# Altium schematic sheet SD Card.SchDoc
size 152 x 152 mm
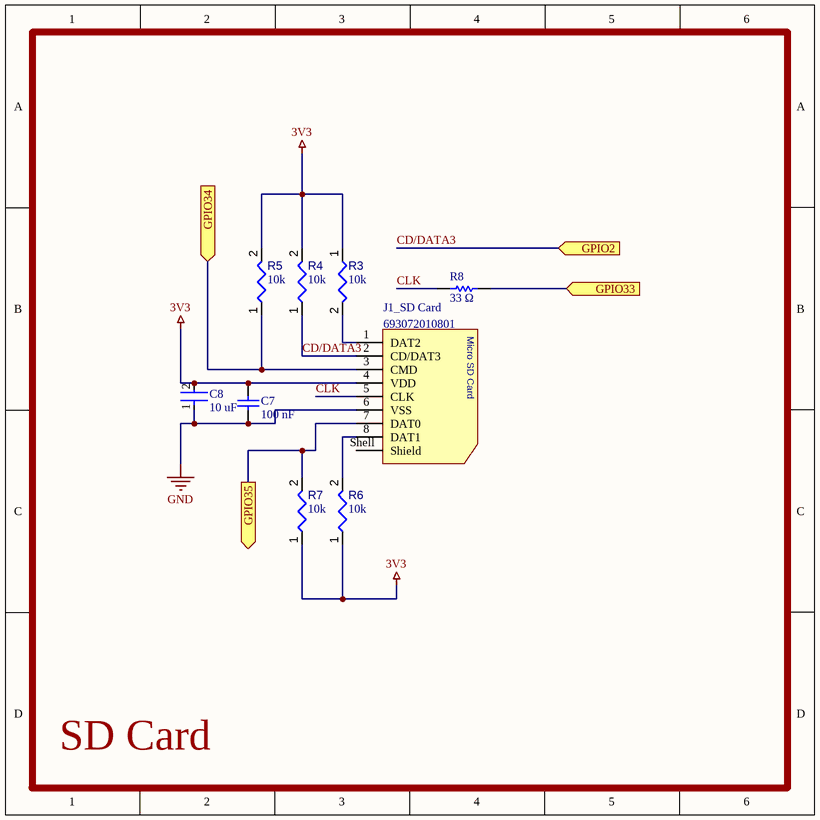
[diagram p0: SD Card.SchDoc]

## Parts
C7  100 nF  [MURA-0603_H_0.9_M]
C8  10 uF  [FP-GRM188-0_1-e0_2_0_55-IPC_A]
J1_SD_Card  693072010801  [693072010801]
R3  value 10k  [RESC1608X55X25ML10T15]  (hidden comment: Resistor 10k +/-1% 0603 100 mW)
R4  value 10k  [RESC1608X55X25ML10T15]  (hidden comment: Resistor 10k +/-1% 0603 100 mW)
R5  value 10k  [RESC1608X55X25ML10T15]  (hidden comment: Resistor 10k +/-1% 0603 100 mW)
R6  value 10k  [RESC1608X55X25ML10T15]  (hidden comment: Resistor 10k +/-1% 0603 100 mW)
R7  value 10k  [RESC1608X55X25ML10T15]  (hidden comment: Resistor 10k +/-1% 0603 100 mW)
R8  33 Ω  [RESC1608X55X25LL10T15]

## Ports
GPIO2 (in), GPIO33 (in), GPIO34 (in), GPIO35 (out)

## Nets
3V3: C7.1 C8.2 J1_SD_Card.4(VDD) R3.1 R4.2 R5.2 R6.1 R7.1
GND: C7.2 C8.1 J1_SD_Card.6(VSS)
CD/DATA3: J1_SD_Card.2(CD/DAT3) R4.1 ; port GPIO2
CLK: J1_SD_Card.5(CLK) R8.2
GPIO33: R8.1 ; port GPIO33
GPIO34: J1_SD_Card.3(CMD) R5.1 ; port GPIO34
GPIO35: J1_SD_Card.7(DAT0) R7.2 ; port GPIO35
NetJ1_SD_Card_1: J1_SD_Card.1(DAT2) R3.2
NetJ1_SD_Card_8: J1_SD_Card.8(DAT1) R6.2

Not connected (* = marked no-connect by the designer): J1_SD_Card Shell(Shield)

## Notes on the sheet
- SD Card
- (in symbol CMP-1502-00164-3) Micro SD Card

## Library data of the parts
C7 = CMP-2000-05253-1: CAP, Ceramic, 0.1 uF, 10%, 16 V, 0603, RoHS, Tape and Reel; Manufacturer: Murata; Capacitance - pF: 100000pF; Case Length: 1.6mm; Voltage Rating DC: 16V; Brand: MurataElectronics; Temperature Coefficient / Code: +/-15%; Case Width: 0.8mm; Type: GeneralPurposeMLCC; Capacitance: 0.1uF; Dielectric: X7R; Capacitance - nF: 100nF; Product Category: MultilayerCeramicCapacitorsMLCC-SMD/SMT; Datasheet URL: https://datasheet.ciiva.com/29202/451467-da-01-en-vs-kondensator-0603-29202287.pdf; Termination Style: SMD/SMT; Operating Temperature Range: -55Cto+125C; Case Code - in: 0603; Datasheet Version: Dec-10; Dimensions: 0.8mmWx1.6mmLx0.8mmH; RoHS: Details; Case Code - mm: 1608; Product: GeneralTypeMLCCs; Voltage Rating: 16V; Package / Case: 0603(1608metric); Factory Pack Quantity: 4000; Packaging: Reel; Maximum Operating Temperature: +125C; Manufacturer URL: http://www.murata.com/; Case Height: 0.8mm; Minimum Operating Temperature: -55C; Series: GRM; Tolerance: 10%
C8 = CMP-2006-02792-2: Chip Multilayer Ceramic Capacitors for General Purpose, 0603, 10uF, X5R, 15%, 20%, 6.3V; Packaging: Tape and Reel; Voltage Rating (DC): 6.3V; Width: 0.031inch; Termination: SMD/SMT; Dielectric: X5R; Package Quantity: 4000; Voltage Rating: 6.3V; Capacitance: 10uF; Case/Package: 0603; Min Operating Temperature: -55°C; Voltage: 6.3V; Length: 1.6mm; Thickness: 0.035inch; Lead Free: Lead Free; Depth: 0.8mm; Case Code (Imperial): 0603; Max Operating Temperature: 85°C; Material: Ceramic; Height: 0.8mm; Tolerance: 20%; Mount: Surface Mount; REACH SVHC: No SVHC; Radiation Hardening: No; Case Code (Metric): 1608
J1_SD_Card = CMP-1502-00164-3: Conn, Memory Skt, Microsd, 8POS, Hinged Rohs Compliant: Yes; Insulation Resistance: 1GΩ; Connector Type: Connector; Memory Type: FLASH; Number of Contacts: 8; Voltage Rating: 100V; Current Rating: 500mA; Contact Material: Gold; Min Operating Temperature: -25°C; Number of Pins: 8; Contact Plating: Gold; REACH SVHC: Unknown; RoHS: Compliant; Color: Black; Number of Positions: 8; Mount: Surface Mount; Length: 14.5mm; Height: 1.95mm; Packaging: Tape and Reel; Max Operating Temperature: 85°C; Width: 13.5mm; Operating Supply Voltage: 100V
R3-R7 = CMP-009-00017-5: Chip Resistor, 10 KOhm, +/- 1%, 01 W, -55 to 155 degC, 0603 (1608 Metric); Voltage Rating: 50V; Power: 100mW; RoHS Compliant: True; Min Operating Temperature: -55°C; Pins: 2; Case/Package: 0603; Mounting Technology: SM; Max Operating Temperature: 155°C; Tolerance: 1%
R8 = CMP-2000-06939-1: Chip Resistor, 33 Ohm, +/- 1%, 0.1 W, -55 to 155 degC, 0603 (1608 Metric), RoHS, Tape and Reel; Temperature Coefficient: 100PPM/C; Voltage Rating: 75V; Unit Weight: 0.000071oz; Power Rating: 100mW; Brand: Yageo; Resistance: 33Ohms; Product Category: ThickFilmResistors; Packaging: Reel; Tolerance: 1%; RoHS: True; Height: 0.45mm; Case Code - mm: 1608; Series: RC; Datasheet URL: http://www.yageo.com/documents/recent/PYu-RC_Group_51_RoHS_L_7.pdf; Operating Temperature Range: -55Cto+155C; Type: GeneralPurposeChipResistorSurfaceMount; Product: ThickFilmResistorsGeneralPurpose; Package / Case: 0603(1608metric); Width: 0.8mm; Length: 1.6mm; Case Code - in: 0603; Mounting Technology: SurfaceMount; Manufacturer URL: http://www.yageo.com/; Manufacturer: Yageo; Package Reference: 0603; Termination Style: SMD/SMT; Datasheet Version: Rev. 7, 05/2017; Package Description: 2-Pin Surface Mount Device, Body 1.6 x 0.8 mm